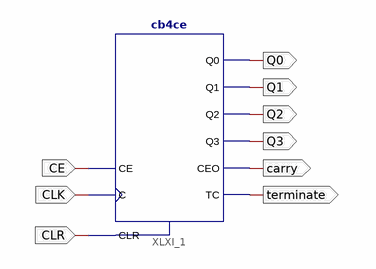
[diagram p0: schematic sheet 1]
// Xilinx ISE schematic cnt4b.sch (spartan3e) as structural Verilog: 1 symbols, 9 ports
module cnt4b (
  input  CE,
  input  CLK,
  input  CLR,
  output Q0,
  output Q1,
  output Q2,
  output Q3,
  output carry,
  output terminate
);

  cb4ce XLXI_1 (.C(CLK), .CE(CE), .CLR(CLR), .CEO(carry), .Q0(Q0), .Q1(Q1), .Q2(Q2), .Q3(Q3), .TC(terminate));
endmodule
